# EAGLE design SerialSD (EAGLE 9.3.0)
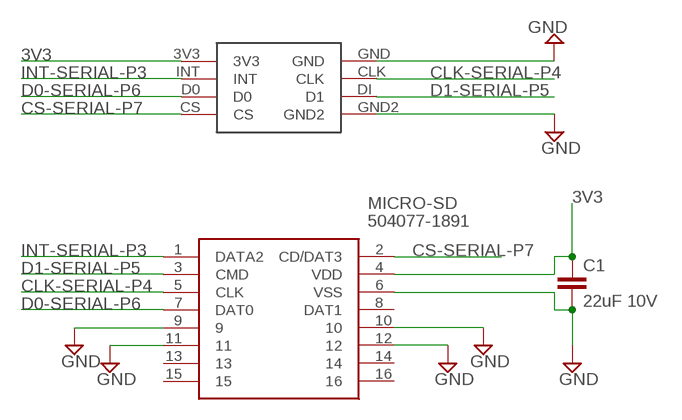
[diagram p0: schematic, sheet 1]

## Parts
C1  22uF 10V  C-EUC0805  [C0805]
MICRO-SD  504077-1891  [5040771891]
U$1  SERAIL1  [SERIAL1]

## Nets
3V3: C1.1 MICRO-SD.4(VDD) U$1.3V3
CLK-SERIAL-P4: MICRO-SD.5(CLK) U$1.CLK
CS-SERIAL-P7: MICRO-SD.2(CD/DAT3) U$1.CS
D0-SERIAL-P6: MICRO-SD.7(DAT0) U$1.D0
D1-SERIAL-P5: MICRO-SD.3(CMD) U$1.DI(D1)
GND: C1.2 MICRO-SD.6(VSS) MICRO-SD.9 MICRO-SD.10 MICRO-SD.11 MICRO-SD.12 U$1.GND U$1.GND2
INT-SERIAL-P3: MICRO-SD.1(DATA2) U$1.INT
Unconnected: MICRO-SD.8(DAT1) MICRO-SD.13 MICRO-SD.14 MICRO-SD.15 MICRO-SD.16

## Library data of the parts
C1 = rcl:C-EU: CAPACITOR, European symbol; SPICEPREFIX: C
MICRO-SD = 504077-1891:504077-1891: Micro SD card Connector + detect switch Micro SD card Connector + detect switch Source: Datasheet <http://docs-emea.rs-online.com/webdocs/13c5/0900766b813c5539.pdf>; ALLIED_NUMBER: 70374974; ALLIED_PRICE-STOCK: http://www.alliedelec.com/molex-incorporated-504077-1891/70374974/; DESCRIPTION: Micro SD card Connector + detect switch Micro SD card Connector + detect switch; HEIGHT: 1mm; MANUFACTURER_NAME: Molex; MANUFACTURER_PART_NUMBER: 504077-1891; MOUSER_PART_NUMBER: 538-504077-1891; MOUSER_PRICE-STOCK: https://www.mouser.com/Search/Refine.aspx?Keyword=538-504077-1891; RS_PART_NUMBER: 7768306; RS_PRICE-STOCK: http://uk.rs-online.com/web/p/products/7768306
U$1 = Serial1:SERAIL1

## Board
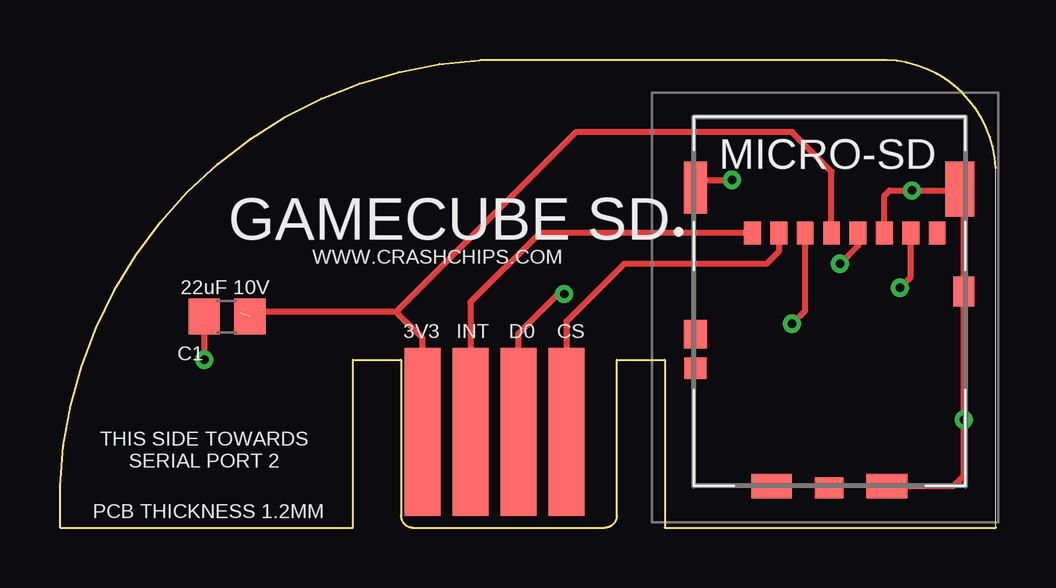
[diagram p1: board, top side]
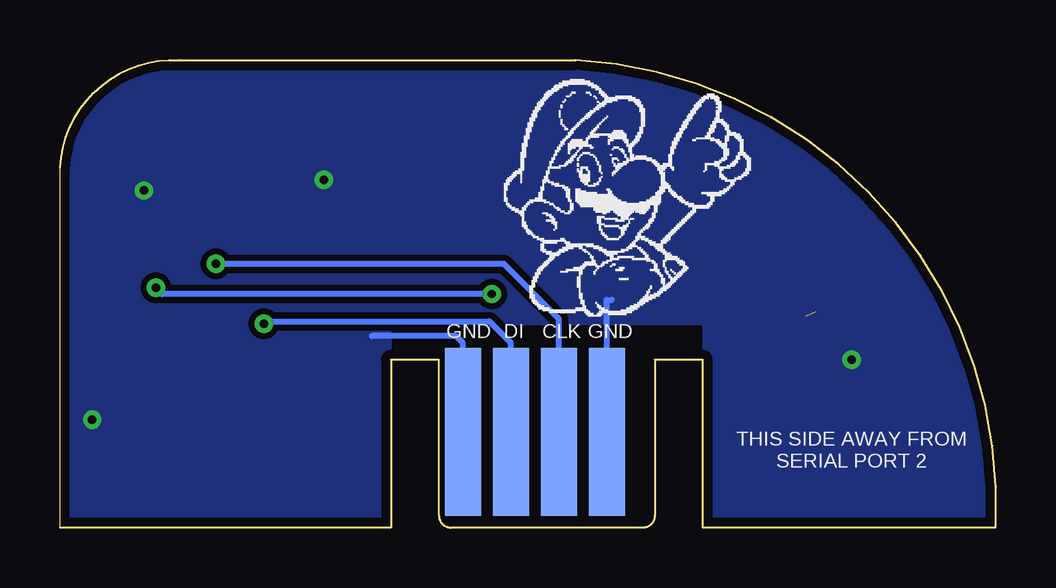
[diagram p2: board, bottom side, seen from below]

Size 39.01 x 19.5 mm. Coordinates in mm from the lower left corner, seen from the top.
Outline: 12.21,0 0.01,0 arc-90 17.51,19.5 34.01,19.5 arc-90 39.01,15 39.01,0 25.21,0
Copper layers (1*16): Top 0.035mm / dielectric 1.5mm / Bottom 0.035mm
Design rules "default *": minimum track width 6mil, minimum drill 0.35mm, track to track 10mil, track to pad 10mil, pad to pad 10mil, via to via 10mil, smd to smd 10mil, copper to edge 15mil, drill to drill 6mil, minimum pad ring 10mil, minimum via ring 8mil, stop-mask expansion 4mil, vias tented up to drill 0mil, thermal gap 10mil

### Footprints (pad centres in the part's own frame; a part is rotated, then mirrored left to right if it is on the bottom)
C0805 = smd 1.3 x 1.5: 1 -0.95,0; 2 0.95,0
5040771891 = smd 0.7 x 0.95: 1 -2.847,2.887; 2 -1.747,2.887; 3 -0.647,2.887; 4 0.453,2.887; 5 1.553,2.887; 6 2.653,2.887; 7 3.753,2.887; 8 4.853,2.887 | smd 0.95 x 2.17: 9 -5.222,4.787 | smd 1.19 x 2.3: 10 5.798,4.722 | smd 0.88 x 1.25: 11 5.963,0.447 | smd 1.7 x 1.03: 12 2.753,-7.663; 13 -2.047,-7.663 | smd 1.2 x 0.88: 14 0.353,-7.738 | smd 0.95 x 1.2: 15 -5.222,-1.338 | smd 0.9 x 0.9: 16 -5.222,-2.748
SERIAL1 = smd 1.5 x 7: 3V3 2.9,4; CS 8.9,4; D0 6.9,4; INT 4.9,4 | smd 1.5 x 7 bottom: CLK 6,4; DI 8,4; GND 10,4; GND2 4,4

### Placement (x,y rotation side)
C1  6.96,8.8 180 top
MICRO-SD  31.71,9.4 0 top
U$1  12.21,0 0 top

### Tracks (layer width: path | path; a pad name or v marks a point on that pad's centre or on a via)
3V3  (1 unrouted)
  Top 0.254: U$1.3V3 15.11,7.9 14.01,9 | 14.01,9 7.51,9 | MICRO-SD.4 32.17,14.85 30.51,16.5 21.51,16.5 14.01,9
CLK-SERIAL-P4  (via drill 0.35)
  Top 0.254: v32.51,11 33.27,11.75 MICRO-SD.5
  Bottom 0.254: U$1.CLK 18.21,8.7 20.51,11 v32.51,11
CS-SERIAL-P7
  Top 0.254: MICRO-SD.2 29.97,11.52 29.44,11 23.51,11 21.11,8.6 U$1.CS
D0-SERIAL-P6  (via drill 0.35)
  Top 0.254: U$1.D0 19.11,8.1 20.75,9.74 v21.01,9.74 | v35.01,10 35.47,10.45 MICRO-SD.7
  Bottom 0.254: v35.01,10 34.75,9.74 v21.01,9.74
D1-SERIAL-P5  (via drill 0.35)
  Top 0.254: v30.51,8.5 31.07,9.05 MICRO-SD.3
  Bottom 0.254: U$1.DI 20.21,7.7 21.11,8.6 30.41,8.6 v30.51,8.5
GND  (via drill 0.35)
  Top 0.254: MICRO-SD.12 37.25,1.74 37.68,2.16 v37.68,4.5 MICRO-SD.11 37.68,13.96 37.57,14.06 | 37.57,14.06 MICRO-SD.10 | MICRO-SD.6 34.37,13.85 34.57,14.06 v35.51,14.06 37.57,14.06 | MICRO-SD.9 26.8,14.5 v28.01,14.5 | C1.2 v6.01,7
  Bottom 0.254: U$1.GND2 16.21,9.5 16.01,9.5 | U$1.GND 22.21,7.7 22.51,7.99 26.01,7.99
  pour Bottom: 0.01,0 0.01,1 arc-90 18.51,19.5 34.21,19.5 arc-90 39.01,14.7 39.01,0 25.21,0 25.21,8.5 12.21,8.5 12.21,0
INT-SERIAL-P3
  Top 0.254: MICRO-SD.1 20,12.29 17.11,9.4 U$1.INT

### Text on the board
tPlace: GAMECUBE SD | WWW.CRASHCHIPS.COM | 3V3 | INT | D0 | CS | THIS SIDE TOWARDS / SERIAL PORT 2
bPlace: GND | CLK | DI | GND | THIS SIDE AWAY FROM / SERIAL PORT 2
tNames: PCB THICKNESS 1.2MM